# Altium schematic sheet Power.SchDoc
size Letter
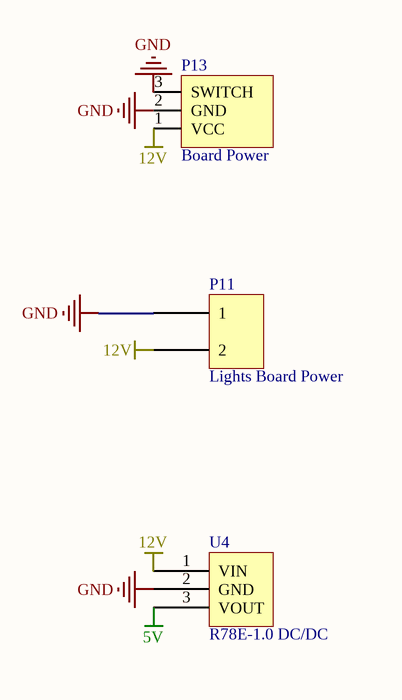
[diagram p0: Power.SchDoc]

## Parts
P11  Lights Board Power  [Molex Mini-Fit Jr 2x1]
P13  Board Power  [BARREL JACK PJ007]
U4  R78E-1.0 DC/DC  [R78-1.0]

## Nets
5V: U4.3(VOUT)
12V: P11.2 P13.1(VCC) U4.1(VIN)
GND: P11.1 P13.2(GND) P13.3(SWITCH) U4.2(GND)

## Library data of the parts
P11 = Molex Mini-Fit 1x2
P13 = Component_1
U4 = R78E-1.0